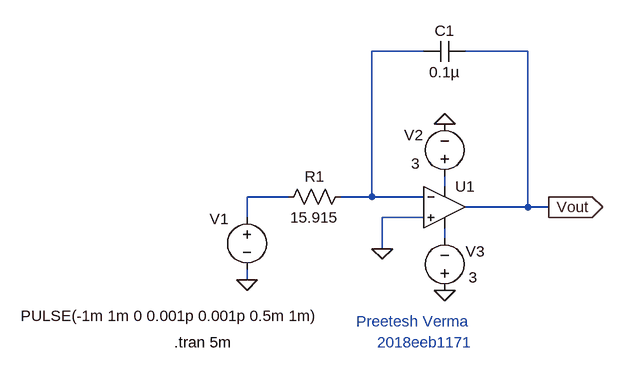
[diagram p0: schematic OpAmp_Integrator.asc]
OpAmp_Integrator.asc, the LTspice schematic file:
Version 4
SHEET 1 880 680
WIRE 192 -64 112 -64
WIRE 352 -64 256 -64
WIRE 224 144 224 128
WIRE -16 160 -80 160
WIRE 112 160 112 -64
WIRE 112 160 64 160
WIRE 192 160 112 160
WIRE 352 176 352 -64
WIRE 352 176 256 176
WIRE 384 176 352 176
WIRE -80 192 -80 160
WIRE 192 192 128 192
WIRE 224 224 224 208
WIRE 128 240 128 192
WIRE -80 288 -80 272
FLAG 224 48 0
FLAG 224 304 0
FLAG 128 240 0
FLAG -80 288 0
FLAG 384 176 Vout
IOPIN 384 176 Out
SYMBOL voltage -80 176 R0
WINDOW 0 -57 18 Left 2
WINDOW 3 -348 167 Left 2
WINDOW 123 0 0 Left 0
WINDOW 39 0 0 Left 0
SYMATTR InstName V1
SYMATTR Value PULSE(-1m 1m 0 0.001p 0.001p 0.5m 1m)
SYMBOL voltage 224 144 R180
WINDOW 0 33 79 Left 2
WINDOW 3 38 35 Left 2
WINDOW 123 0 0 Left 0
WINDOW 39 0 0 Left 0
SYMATTR InstName V2
SYMATTR Value 3
SYMBOL voltage 224 320 R180
WINDOW 0 -62 76 Left 2
WINDOW 3 -51 36 Left 2
WINDOW 123 0 0 Left 0
WINDOW 39 0 0 Left 0
SYMATTR InstName V3
SYMATTR Value 3
SYMBOL cap 256 -80 R90
WINDOW 0 0 32 VBottom 2
WINDOW 3 32 32 VTop 2
SYMATTR InstName C1
SYMATTR Value 0.1µ
SYMBOL res 80 144 R90
WINDOW 0 0 56 VBottom 2
WINDOW 3 32 56 VTop 2
SYMATTR InstName R1
SYMATTR Value 15.915
SYMBOL Opamps\\UniversalOpamp2 224 176 R0
SYMATTR InstName U1
SYMATTR Value2 Avol=1Meg GBW=100000Meg Slew=10Meg
TEXT -192 384 Left 2 !.tran 5m
TEXT 88 352 Left 2 ;Preetesh Verma
TEXT 120 384 Left 2 ;2018eeb1171

The netlist it stands for:
* OpAmp_Integrator.asc
V1 N003 0 PULSE(-1m 1m 0 0.001p 0.001p 0.5m 1m)
V2 N002 0 3
V3 0 N004 3
C1 Vout N001 0.1µ
R1 N001 N003 15.915
XU1 0 N001 N002 N004 Vout level.2 Avol=1Meg GBW=100000Meg Slew=10Meg ilimit=25m rail=0 Vos=0 phimargin=45 en=0 enk=0 in=0 ink=0 Rin=500Meg  ; pins IN+ IN- V+ V- OUT
.tran 5m
* Preetesh Verma
* 2018eeb1171
.lib UniversalOpamps2.sub
.backanno
.end